# EAGLE design Steuerplatine_V2_0 (EAGLE 7.7.0)
ABTEILUNG: Technische Informatik; BEARBEITER: CrazyCar2020; DATUM: 04/2019; DOKUMENTART: Schaltplan; GEZ: LedC; REV: 001; SCHALTPLAN: CrazyCar2020; SCHALTPLAN2: Steuerplatine; STATUS: Prototyp; VER: 0
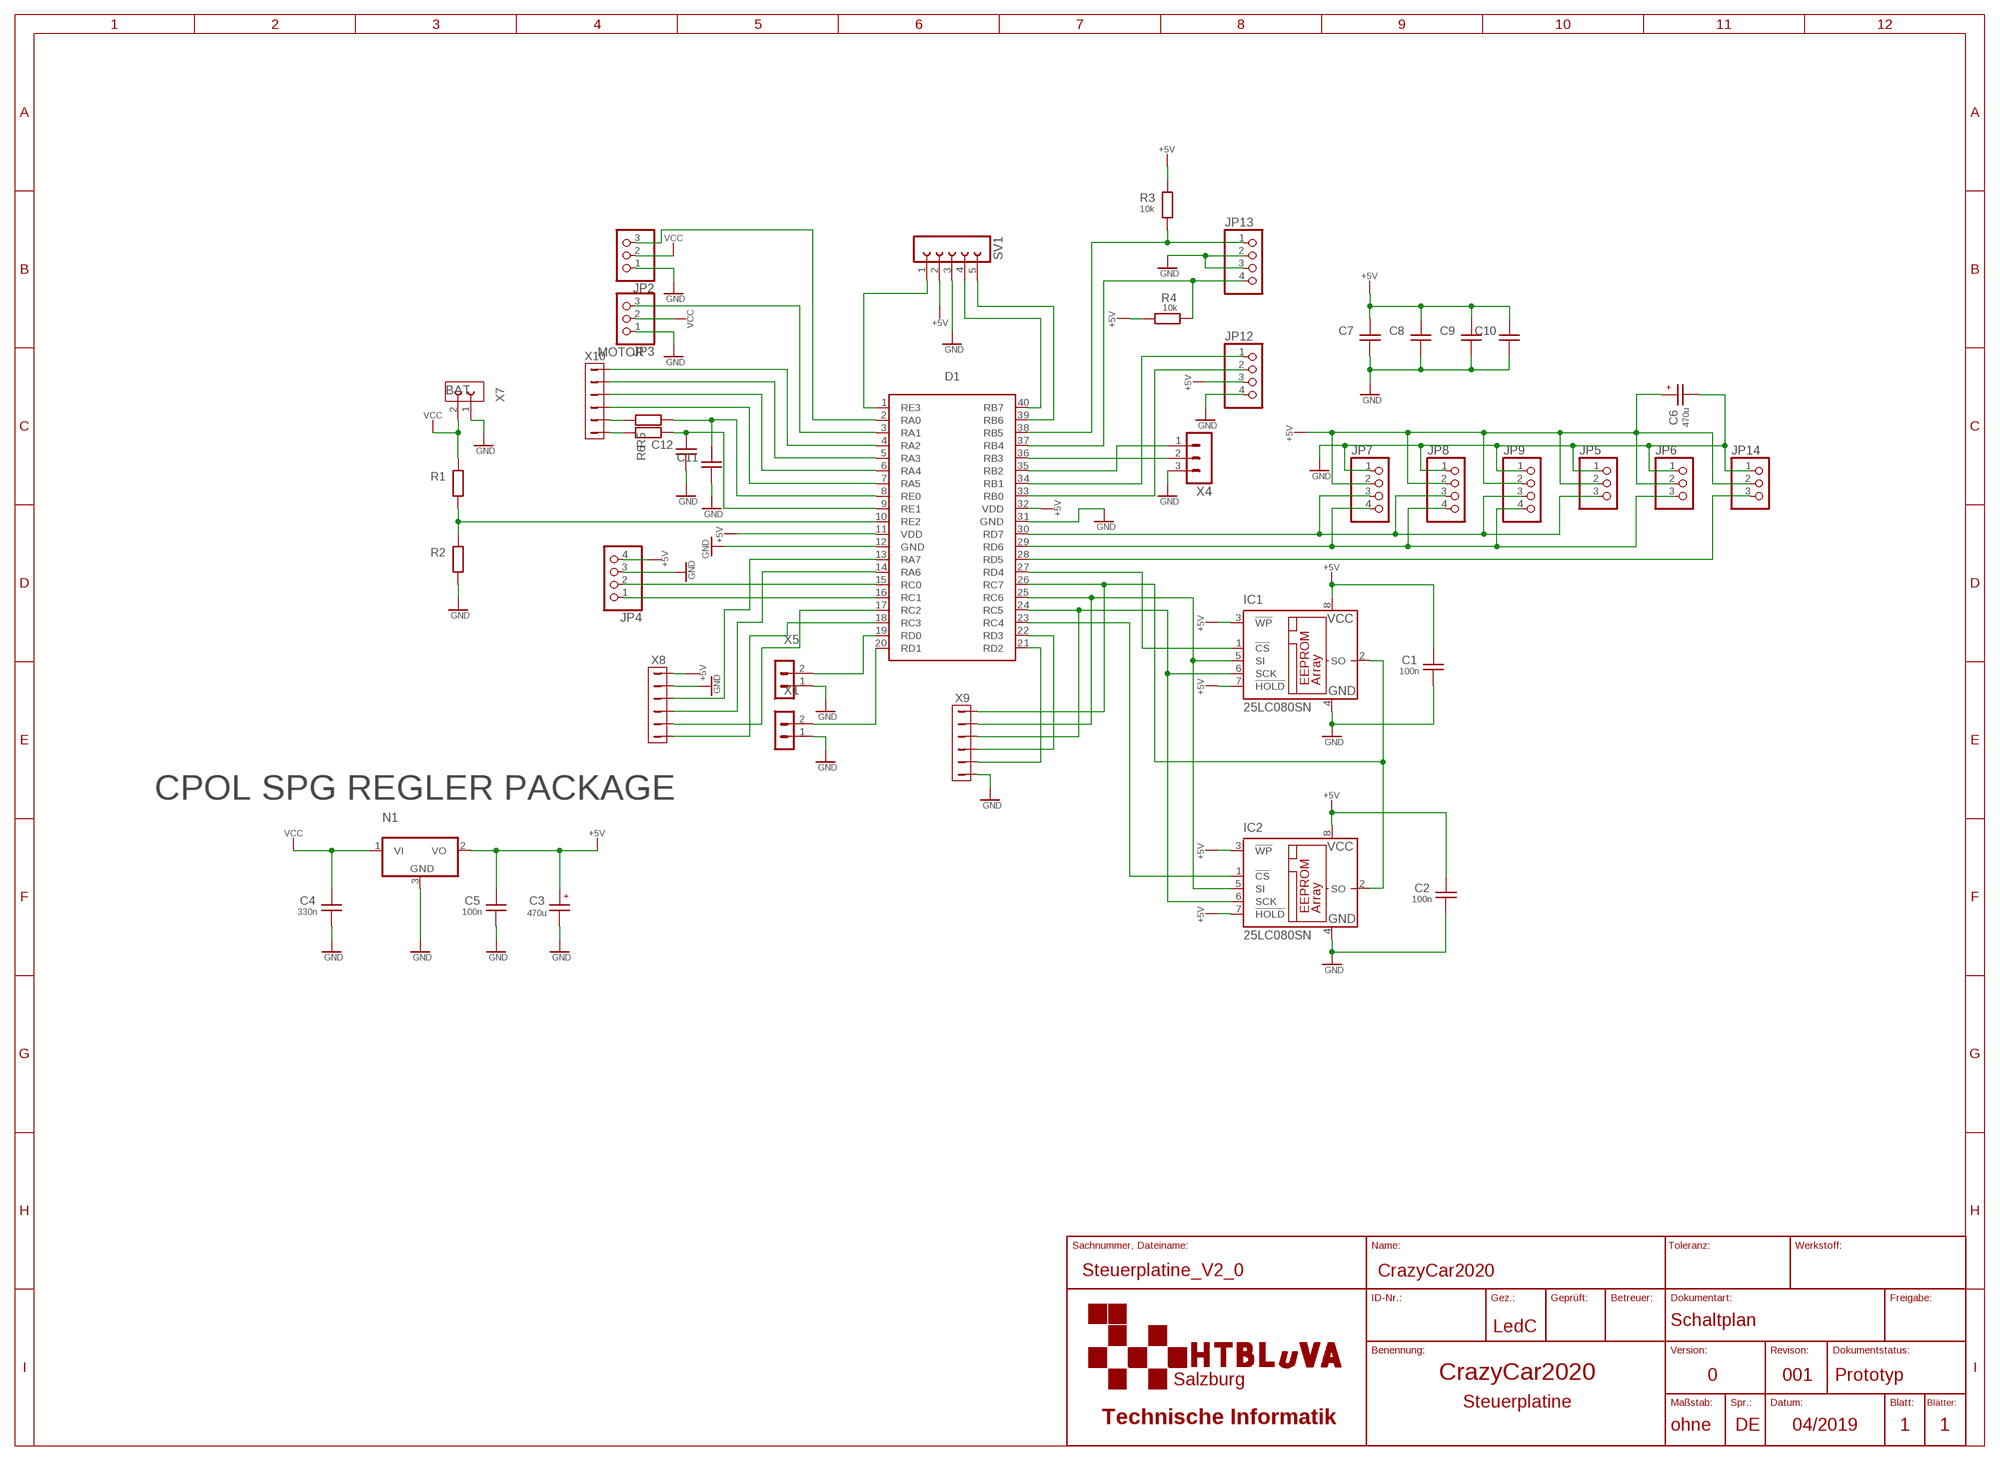
[diagram p0: schematic, sheet 1]

## Parts
C1  100n  C-V_C0603  [C0603]
C2  100n  C-V_C0603  [C0603]
C3  470u  C-POL-V_E5-10.5  [E5-10,5]
C4  330n  C-V_C1206  [C1206]
C5  100n  C-V_C1206  [C1206]
C6  470u  C-POL-V_E5-10.5  [E5-10,5]
C7  C-V_C1206  [C1206]
C8  C-V_C1206  [C1206]
C9  C-V_C1206  [C1206]
C10  C-V_C1206  [C1206]
C11  C-V_C1206  [C1206]
C12  C-V_C1206  [C1206]
D1  EVAL_BRD_PIC18F46K421  [EVAL_BRD_PIC18F46K42]
IC1  25LC080SN  [SO-08]
IC2  25LC080SN  [SO-08]
JP2  PINHD-1X3  [1X03]
JP3  PINHD-1X3  [1X03]
JP4  PINHD-1X4  [1X04]
JP5  PINHD-1X3  [1X03]
JP6  PINHD-1X3  [1X03]
JP7  PINHD-1X4  [1X04]
JP8  PINHD-1X4  [1X04]
JP9  PINHD-1X4  [1X04]
JP12  PINHD-1X4  [1X04]
JP13  PINHD-1X4  [1X04]
JP14  PINHD-1X3  [1X03]
N1  7805DT  [TO252]
R1  R-V_R1206  [R1206]
R2  R-V_R1206  [R1206]
R3  10k  R-V_R1206  [R1206]
R4  10k  R-V_R1206  [R1206]
R5  R-V_R1206  [R1206]
R6  R-V_R1206  [R1206]
SV1  FE05-1  [FE05-1]
X1  M02  [02P]
X4  MA03-1  [MA03-1]
X5  M02  [02P]
X7  PRINTKLEMME2_PHOENIX_MPT  [PHOENIX_MPT]
X8  MA06-1_  [MA06-1]
X9  MA06-1_  [MA06-1]
X10  MA06-1_  [MA06-1]

## Nets
+5V: C1.1 C2.1 C3.+ C5.1 C6.+ C7.1 C8.1 C9.1 C10.1 D1.11(VDD) D1.32(VDD) IC1.3(!WP) IC1.7(!HOLD) IC1.8(VCC) IC2.3(!WP) IC2.7(!HOLD) IC2.8(VCC) JP4.4 JP5.2 JP6.2 JP7.2 JP8.2 JP9.2 JP12.3 JP14.2 N1.2(VO) R3.2 R4.1 SV1.2 X8.6
GND: C1.2 C2.2 C3.- C4.2 C5.2 C6.- C7.2 C8.2 C9.2 C10.2 C11.2 C12.2 D1.12(GND) D1.31(GND) IC1.4(GND) IC2.4(GND) JP2.1 JP3.1 JP4.3 JP5.1 JP6.1 JP7.1 JP8.1 JP9.1 JP12.4 JP13.2 JP13.3 JP14.1 N1.3(GND) R2.1 SV1.3 X1.1 X4.3 X5.1 X7.1 X8.5 X9.1
N$1: D1.10(RE2) R1.1 R2.2
N$2: D1.24(RC5) IC1.6(SCK) IC2.6(SCK) X9.4
N$3: C12.1 D1.9(RE1) R6.1
N$4: C11.1 D1.8(RE0) R5.1
N$5: D1.7(RA5) X10.3
N$6: D1.6(RA4) X10.4
N$7: D1.5(RA3) X10.5
N$8: D1.23(RC4) IC2.1(!CS)
N$9: D1.4(RA2) X10.6
N$10: D1.2(RA0) JP2.3
N$11: D1.3(RA1) JP3.3
N$12: D1.29(RD6) JP6.3 JP7.4 JP8.4 JP9.4
N$13: D1.33(RB0) JP12.2
N$14: D1.30(RD7) JP5.3 JP7.3 JP8.3 JP9.3
N$15: D1.21(RD2) X9.2
N$16: D1.28(RD5) JP14.3
N$17: D1.26(RC7) IC1.2(SO) IC2.2(SO) X9.6
N$18: D1.27(RD4) IC1.1(!CS)
N$19: D1.16(RC1) JP4.1
N$20: D1.15(RC0) JP4.2
N$21: D1.25(RC6) IC1.5(SI) IC2.5(SI) X9.5
N$22: D1.22(RD3) X9.3
N$23: D1.13(RA7) X8.4
N$24: D1.36(RB3) X4.2
N$25: D1.35(RB2) X4.1
N$26: D1.14(RA6) X8.3
N$27: D1.34(RB1) JP12.1
N$28: R5.2 X10.2
N$29: D1.18(RC3) X8.1
N$30: D1.38(RB5) JP13.1 R3.1
N$31: D1.37(RB4) JP13.4 R4.2
N$32: D1.17(RC2) X8.2
N$34: D1.40(RB7) SV1.4
N$35: D1.39(RB6) SV1.5
N$36: D1.1(RE3) SV1.1
N$37: D1.19(RD0) X5.2
N$38: D1.20(RD1) X1.2
N$40: R6.2 X10.1
VCC: C4.1 JP2.2 JP3.2 N1.1(VI) R1.2 X7.2

## Notes on the sheet
- MOTOR
- BAT
- CPOL SPG REGLER PACKAGE

## Library data of the parts
C1 C2 C4 C5 C7-C12 = rcl_HTBL:C-V_: CAPACITOR, European symbol
C3 C6 = rcl_HTBL:C-POL-V_: POLARIZED CAPACITOR, European symbol
D1 = ic-processor_LedC:EVAL_BRD_PIC18F46K42: Buchsenleiste RM2,54 mm Modelle SPF, AWRF usw.
IC1 IC2 = ic-processor_LedC:25*: Serial EEPROM 4K/ 8K , SPI bus; MF: MICROCHIP; MPN: 25LC080/SN; OC_FARNELL: 1137302; OC_NEWARK: 96K4092
JP2 JP3 JP5 JP6 JP14 = RPoettinger:PINHD-1X3: PIN HEADER
JP4 JP7-JP9 JP12 JP13 = RPoettinger:PINHD-1X4: PIN HEADER
N1 = RPoettinger:78*: Positive VOLTAGE REGULATOR Source: http://cache.national.com/ds/LM/LM78L05.pdf http://www.fairchildsemi.com/ds/LM/LM7805.pdf
R1-R6 = rcl_HTBL:R-V_: RESISTOR, European symbol
SV1 = RPoettinger:FE05-1: FEMALE HEADER; OC_FARNELL: unknown; OC_NEWARK: unknown
X1 X5 = RPoettinger:M02: AMP QUICK CONNECTOR; OC_FARNELL: unknown; OC_NEWARK: unknown
X4 = RPoettinger:MA03-1: PIN HEADER; OC_FARNELL: unknown; OC_NEWARK: unknown
X7 = con_HauP:PRINTKLEMME2_: MKDSN 1,5/ 2-5,08 Printklemme Nennstrom: 13,5 A Nennspannung: 250 V Rastermaß: 5,08 mm Polzahl: 2 Anschlussart: Schraubanschluss Montage: Löten Anschlussrichtung Leiter/Platine: 0 ° Artikelnummer: 1729128 Source: http://eshop.phoenixcontact.com .. 1729128.pdf
X8-X10 = con_HauP:MA06-1_: PIN HEADER

## Board
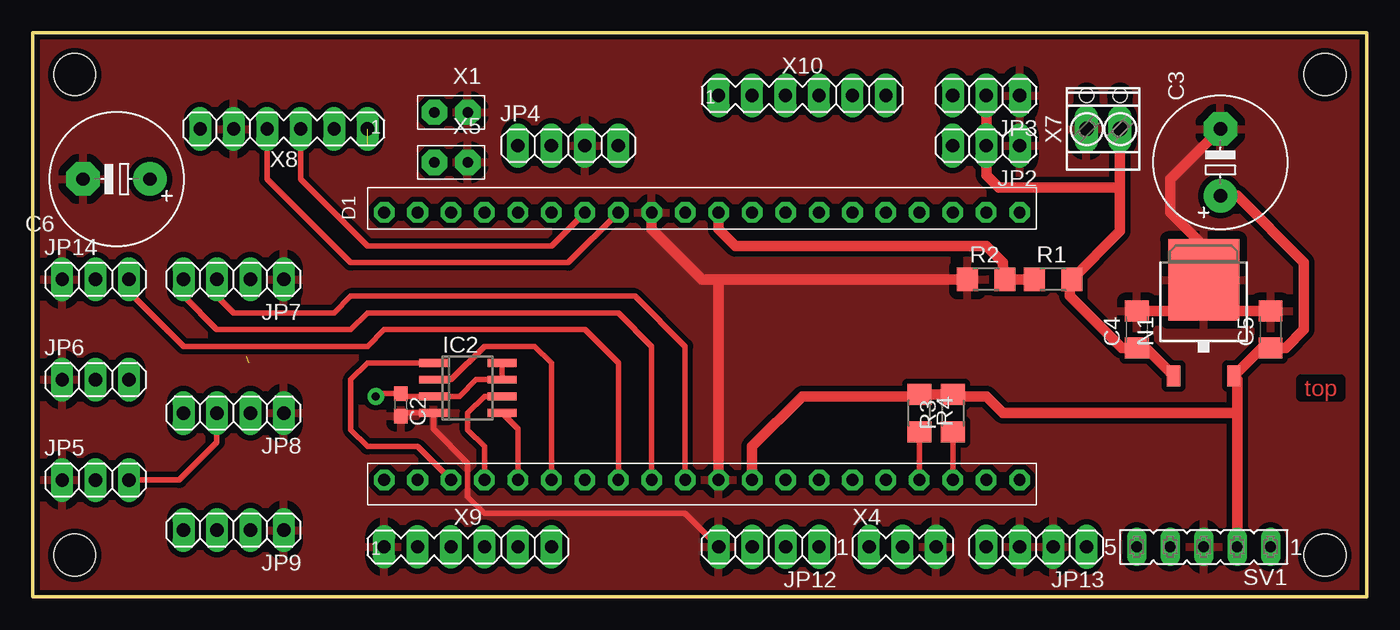
[diagram p1: board, top side]
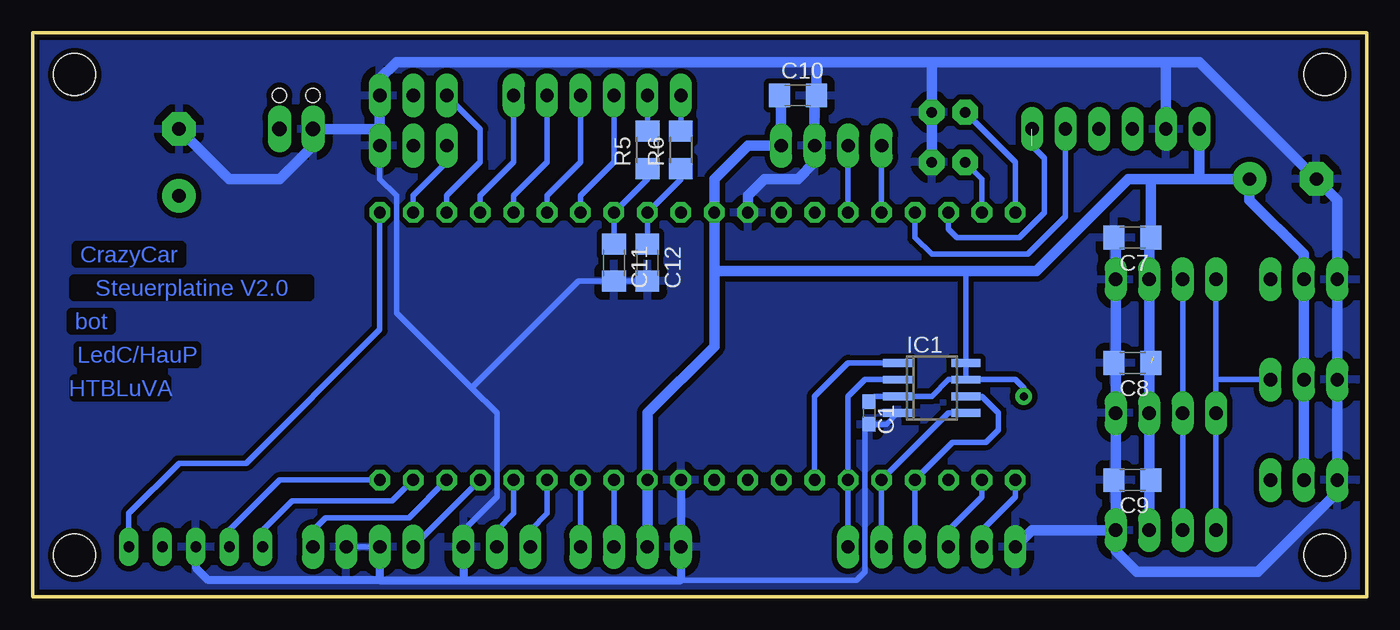
[diagram p2: board, bottom side, seen from below]

Size 101.27 x 42.85 mm. Coordinates in mm from the lower left corner, seen from the top.
Outline: 0,0 101.27,0 101.27,42.85 0,42.85 0,0
Copper layers (1+16): Top 0.035mm / dielectric 1.5mm / Bottom 0.035mm
Design rules "HTL_DK_V1": minimum track width 10mil, minimum drill 0.5mm, track to track 8mil, track to pad 8mil, pad to pad 8mil, via to via 8mil, smd to smd 8mil, copper to edge 10mil, drill to drill 8mil, minimum pad ring 13mil, minimum via ring 13mil, stop-mask expansion 4mil, vias tented up to drill 20mil, thermal gap 24mil
Holes 3.2 mm at 98.11,39.69 98.11,3.17 3.17,3.17 3.17,39.69

### Footprints (pad centres in the part's own frame; a part is rotated, then mirrored left to right if it is on the bottom)
C0603 = smd 1.1 x 1: 1 -0.85,0; 2 0.85,0
E5-10,5 = drill 1.016 pad 2.54: + -2.54,0 | drill 1.016 pad 2.54 octagon: - 2.54,0
C1206 = smd 1.6 x 1.8: 1 -1.4,0; 2 1.4,0
EVAL_BRD_PIC18F46K42 = drill 0.9 octagon: 1 0,39.37; 2 0,36.83; 3 0,34.29; 4 0,31.75; 5 0,29.21; 6 0,26.67; 7 0,24.13; 8 0,21.59; 9 0,19.05; 10 0,16.51; 11 0,13.97; 12 0,11.43; 13 0,8.89; 14 0,6.35; 15 0,3.81; 16 0,1.27; 17 0,-1.27; 18 0,-3.81; 19 0,-6.35; 20 0,-8.89; 21 20.32,-8.89; 22 20.32,-6.35; 23 20.32,-3.81; 24 20.32,-1.27; 25 20.32,1.27; 26 20.32,3.81; 27 20.32,6.35; 28 20.32,8.89; 29 20.32,11.43; 30 20.32,13.97; 31 20.32,16.51; 32 20.32,19.05; 33 20.32,21.59; 34 20.32,24.13; 35 20.32,26.67; 36 20.32,29.21; 37 20.32,31.75; 38 20.32,34.29; 39 20.32,36.83; 40 20.32,39.37
SO-08 = smd 0.6 x 2.2: 1 -1.905,-2.6; 2 -0.635,-2.6; 3 0.635,-2.6; 4 1.905,-2.6; 5 1.905,2.6; 6 0.635,2.6; 7 -0.635,2.6; 8 -1.905,2.6
1X03 = drill 1.016 long: 1 -2.54,0; 2 0,0; 3 2.54,0
1X04 = drill 1.016 long: 1 -3.81,0; 2 -1.27,0; 3 1.27,0; 4 3.81,0
TO252 = smd 1 x 1.6: 1 -2.28,-4.8; 2 2.28,-4.8 | smd 5.4 x 6.2: 3 0,2.5
R1206 = smd 1.6 x 1.803: 1 -1.422,0; 2 1.422,0
FE05-1 = drill 0.813 long: 1 -5.08,0; 2 -2.54,0; 3 0,0; 4 2.54,0; 5 5.08,0
02P = drill 0.8 pad 1.93 octagon: 1 -1.27,0; 2 1.27,0
MA03-1 = drill 1.016 long: 1 -2.54,0; 2 0,0; 3 2.54,0
PHOENIX_MPT = drill 1.1 pad 1.778 long: 1 0,1.27; 2 0,-1.27 | hole 1.1: 2.54,-1.27; 2.54,1.27
MA06-1 = drill 1 long: 1 -5.08,0; 2 -2.54,0; 3 0,0; 4 2.54,0; 5 5.08,0; 6 7.62,0

### Placement (x,y rotation side)
C1  37.78,13.97 270 bottom
C2  27.94,14.61 270 top
C3  90.17,33.02 90 top
C4  83.82,20.32 90 top
C5  93.98,20.32 90 top
C6  6.35,31.75 180 top
C7  17.78,27.3 180 bottom
C8  17.78,17.78 180 bottom
C9  17.78,8.89 180 bottom
C10  43.18,38.1 0 bottom
C11  57.15,25.4 270 bottom
C12  54.61,25.4 270 bottom
D1  35.56,29.21 270 top
IC1  33.02,15.88 270 bottom
IC2  33.02,15.88 270 top
JP2  72.39,34.29 180 top
JP3  72.39,38.1 180 top
JP4  40.64,34.29 0 top
JP5  4.76,8.89 0 top
JP6  4.76,16.51 0 top
JP7  15.24,24.13 180 top
JP8  15.24,13.97 180 top
JP9  15.24,5.08 180 top
JP12  55.88,3.81 180 top
JP13  76.2,3.81 180 top
JP14  4.76,24.13 0 top
N1  88.9,21.59 0 top
R1  77.47,24.13 0 top
R2  72.39,24.13 0 top
R3  69.85,13.97 90 top
R4  67.31,13.97 270 top
R5  54.61,33.97 90 bottom
R6  52.07,33.97 90 bottom
SV1  88.9,3.81 180 top
X1  31.75,36.83 180 top
X4  66.04,3.81 0 top
X5  31.75,33.02 180 top
X7  81.28,35.56 90 top
X8  20.32,35.56 180 top
X9  31.75,3.81 0 top
X10  57.15,38.1 0 top

### Tracks (layer width: path | path; a pad name or v marks a point on that pad's centre or on a via)
+5V  (via drill 0.6 pad 0.6)  (1 unrouted)
  Top 0.406: IC2.8 IC2.7 33.66,16.51 32.38,15.24 IC2.3 28.26,15.24 28.04,15.46 C2.1 26.25,15.46 v26.04,15.24 | 70,15.24 R3.2 | 67.16,15.24 R4.1 | 91.44,16.53 N1.2
  Top 0.813: R3.2 R4.1 | D1.32 54.61,11.43 58.42,15.24 67.16,15.24 | N1.2 93.31,18.92 C5.1 95.12,18.92 96.52,20.32 96.52,25.4 91.44,30.48 C3.+ | SV1.2 91.44,13.97 | 91.44,13.97 91.44,16.53 | 70,15.24 72.39,15.24 73.66,13.97 91.44,13.97
  Bottom 0.406: IC1.7 IC1.8 30.42,24.51 30.16,24.77 | IC1.7 31.75,16.51 33.02,15.24 IC1.3 37.36,15.24 C1.1 | 16.51,18.6 16.19,18.29 | 16.51,17.65 C8.1 | 16.51,9.02 C9.1 16.51,8.76 | 44.45,37.97 C10.1 | 13.84,31.62 13.97,31.75 | v26.04,15.24 26.04,15.88 26.67,16.51 IC1.7
  Bottom 0.813: JP12.3 D1.32 54.61,13.97 49.53,19.05 49.53,24.77 | JP5.2 JP6.2 JP14.2 4.76,26.04 8.89,30.16 C6.+ 12.7,31.75 | 49.53,24.77 30.16,24.77 25.08,24.77 18.1,31.75 16.51,31.75 | 49.53,24.77 D1.11 49.53,31.75 46.99,34.29 JP4.4 44.45,37.97 | 16.51,18.6 JP7.2 16.51,27.18 C7.1 16.38,31.62 16.51,31.75 | 16.51,17.65 JP8.2 16.51,9.02 | JP9.2 16.51,8.76 | 12.7,31.75 13.97,31.75 16.51,31.75 | X8.6 12.7,31.75
GND
  Top 0.406: C2.2 28.16,13.97 IC2.4 30.42,12.76 33.02,10.16 33.02,7.62 34.29,6.35 49.53,6.35 JP12.4 | 86.53,21.72 N1.3
  Top 0.813: R2.1 52.07,24.13 | D1.31 52.07,24.13 | C5.2 91.27,21.72 N1.3 88.9,26.67 86.36,29.21 86.36,31.75 C3.- | C4.2 86.53,21.72 | 52.07,24.13 50.8,24.13 46.99,27.94 D1.12
  Bottom 0.406: JP13.2 JP13.3 | 67.94,15.88 66.04,13.97 66.04,7.62 68.58,5.08 X4.3 | 67.94,15.88 73.66,21.59 73.66,30.48 74.93,31.75 JP2.1 | IC1.4 36.47,13.12 C1.2 37.78,13.02 38.1,12.7 38.1,1.91 38.73,1.27 52.07,1.27 | 19.05,17.91 C8.2 19.05,17.65 | 19.05,9.02 C9.2 19.05,8.76 | 41.91,37.97 C10.2 41.78,39.24 | 41.78,40.51 41.91,40.64 | C11.2 C12.2 59.82,24 67.94,15.88
  Bottom 0.61: D1.31 JP12.4 52.07,1.27 68.58,1.27 | 74.93,1.27 68.58,1.27 | X4.3 68.58,1.27 | JP13.3 74.93,1.27 | 74.93,1.27 87.95,1.27 88.9,2.22 SV1.3
  Bottom 0.813: 74.93,35.56 JP3.1 74.93,39.37 73.66,40.64 41.91,40.64 33.02,40.64 | 74.93,35.56 JP2.1 | 19.05,17.91 JP7.1 19.05,27.18 C7.2 | 19.05,17.65 JP8.1 19.05,9.02 | JP9.1 19.05,8.76 | JP9.1 19.05,3.49 17.46,1.91 8.26,1.91 2.22,7.94 JP5.1 JP6.1 JP14.1 2.22,30.16 C6.- 12.7,40.64 15.24,40.64 | D1.12 46.99,30.48 45.72,31.75 43.18,31.75 41.91,33.02 JP4.3 41.91,37.97 | C3.- 86.36,31.75 82.55,31.75 80.01,34.29 X7.1 74.93,35.56 | X5.1 X1.1 33.02,40.64 | C10.2 41.78,40.51 | 15.24,40.64 33.02,40.64 | JP9.1 25.4,5.08 X9.1 | X8.5 15.24,40.64
  pour Top (isolate 0.406): 0,45.72 0,0 101.6,0 101.6,45.72
  pour Bottom (isolate 0.406): 0,43.18 0,0 101.6,0 101.6,43.18
N$1
  Top 0.406: 73.66,24.28 R2.2
  Top 0.813: R1.1 R2.2 | D1.10 52.07,27.94 53.34,26.67 72.39,26.67 73.66,25.4 73.66,24.28
N$2
  Top 0.406: D1.24 34.29,11.43 33.02,12.7 33.02,13.97 34.29,15.24 IC2.6
  Bottom 0.406: IC1.6 29.21,15.24 27.94,13.97 27.94,12.7 28.89,11.75 31.43,11.75 D1.24 X9.4
N$3
  Bottom 0.406: R6.1 52.07,31.75 D1.9 C12.1
N$4
  Bottom 0.406: R5.1 54.61,31.75 D1.8 C11.1
N$5
  Bottom 0.406: D1.7 59.69,30.48 57.15,33.02 X10.3
N$6
  Bottom 0.406: D1.6 62.23,30.48 59.69,33.02 X10.4
N$7
  Bottom 0.406: D1.5 64.77,30.48 62.23,33.02 X10.5
N$8
  Top 0.406: D1.23 29.21,11.43 25.4,11.43 24.13,12.7 24.13,16.51 25.4,17.78 IC2.1
N$9
  Bottom 0.406: D1.4 67.31,30.48 64.77,33.02 X10.6
N$10
  Bottom 0.406: D1.2 72.39,30.48 69.85,33.02 JP2.3
N$11
  Bottom 0.406: D1.3 69.85,30.48 67.31,33.02 67.31,35.56 JP3.3
N$12
  Top 0.406: D1.29 46.99,19.05 44.45,21.59 25.4,21.59 24.13,20.32 13.97,20.32 11.43,22.86 JP7.4
  Bottom 0.406: JP9.4 JP8.4 11.43,16.51 | JP7.4 11.43,16.51 | JP6.3 11.43,16.51
N$13
  Bottom 0.406: D1.33 JP12.2
N$14
  Top 0.406: JP5.3 11.11,8.89 13.97,11.75 JP8.3 | D1.30 49.53,19.05 45.72,22.86 24.13,22.86 22.86,21.59 15.24,21.59 13.97,22.86 JP7.3
  Bottom 0.406: JP9.3 JP8.3 JP7.3
N$15
  Bottom 0.406: D1.21 26.67,7.62 29.21,5.08 X9.2
N$16
  Top 0.406: JP14.3 7.3,23.18 11.43,19.05 25.4,19.05 26.67,20.32 41.91,20.32 44.45,17.78 D1.28
N$17
  Top 0.406: IC2.2 31.75,16.51 34.29,19.05 38.1,19.05 39.37,17.78 D1.26
  Bottom 0.406: IC1.2 38.1,16.51 39.37,15.24 D1.26 X9.6
N$18
  Bottom 0.406: D1.27 41.91,15.24 39.37,17.78 IC1.1
N$19
  Bottom 0.406: JP4.1 D1.16
N$20
  Bottom 0.406: JP4.2 D1.15
N$21
  Top 0.406: D1.25 36.83,12.76 IC2.5
  Bottom 0.406: IC1.5 31.75,13.97 D1.25 X9.5
N$22
  Bottom 0.406: D1.22 29.21,7.62 31.75,5.08 X9.3
N$23
  Top 0.406: D1.13 40.64,25.4 24.13,25.4 17.78,31.75 X8.4
N$24
  Bottom 0.406: D1.36 64.77,6.35 66.04,5.08 X4.2
N$25
  Bottom 0.406: D1.35 62.23,6.35 63.5,5.08 X4.1
N$26
  Top 0.406: D1.14 39.37,26.67 25.4,26.67 20.32,31.75 X8.3
N$27
  Bottom 0.406: D1.34 JP12.1
N$28
  Bottom 0.406: X10.2 R5.2
N$29  (1 unrouted)
  Bottom 0.406: D1.18 31.75,27.94 31.11,27.3 26.35,27.3 24.45,29.21 24.45,33.34 25.4,34.29
N$30
  Top 0.406: D1.38 R3.1
  Bottom 0.406: D1.38 72.71,6.03 79.06,6.03 80.01,5.08 JP13.1
N$31
  Top 0.406: D1.37 R4.2
  Bottom 0.406: D1.37 JP13.4
N$32
  Bottom 0.406: D1.17 34.29,27.3 33.02,26.04 25.72,26.04 22.86,28.89 X8.2
N$34
  Bottom 0.406: D1.40 82.55,8.89 86.36,5.08 SV1.4
N$35
  Bottom 0.406: D1.39 73.98,7.3 81.6,7.3 83.82,5.08 SV1.5
N$36
  Bottom 0.406: D1.1 74.93,20.32 85.09,10.16 90.17,10.16 93.98,6.35 SV1.1
N$37
  Bottom 0.406: D1.19 29.21,31.75 X5.2
N$38
  Bottom 0.406: D1.20 26.67,33.02 X1.2
N$40
  Bottom 0.406: X10.1 R6.2
VCC
  Top 0.406: 78.89,23.85 R1.2 78.74,23.98 | C4.1 84.49,18.92
  Top 0.813: JP3.2 JP2.2 72.39,32.07 73.34,31.11 82.55,31.11 | X7.2 82.55,31.11 | 82.55,31.11 82.55,27.79 R1.2 | C4.1 82.68,18.92 78.74,22.86 78.74,23.98 | 84.49,18.92 N1.1

### Text on the board
Top: top
Bottom: CrazyCar | Steuerplatine V2.0 | bot | LedC/HauP | HTBLuVA